# EAGLE design DynamixelController (EAGLE 6.5.0)
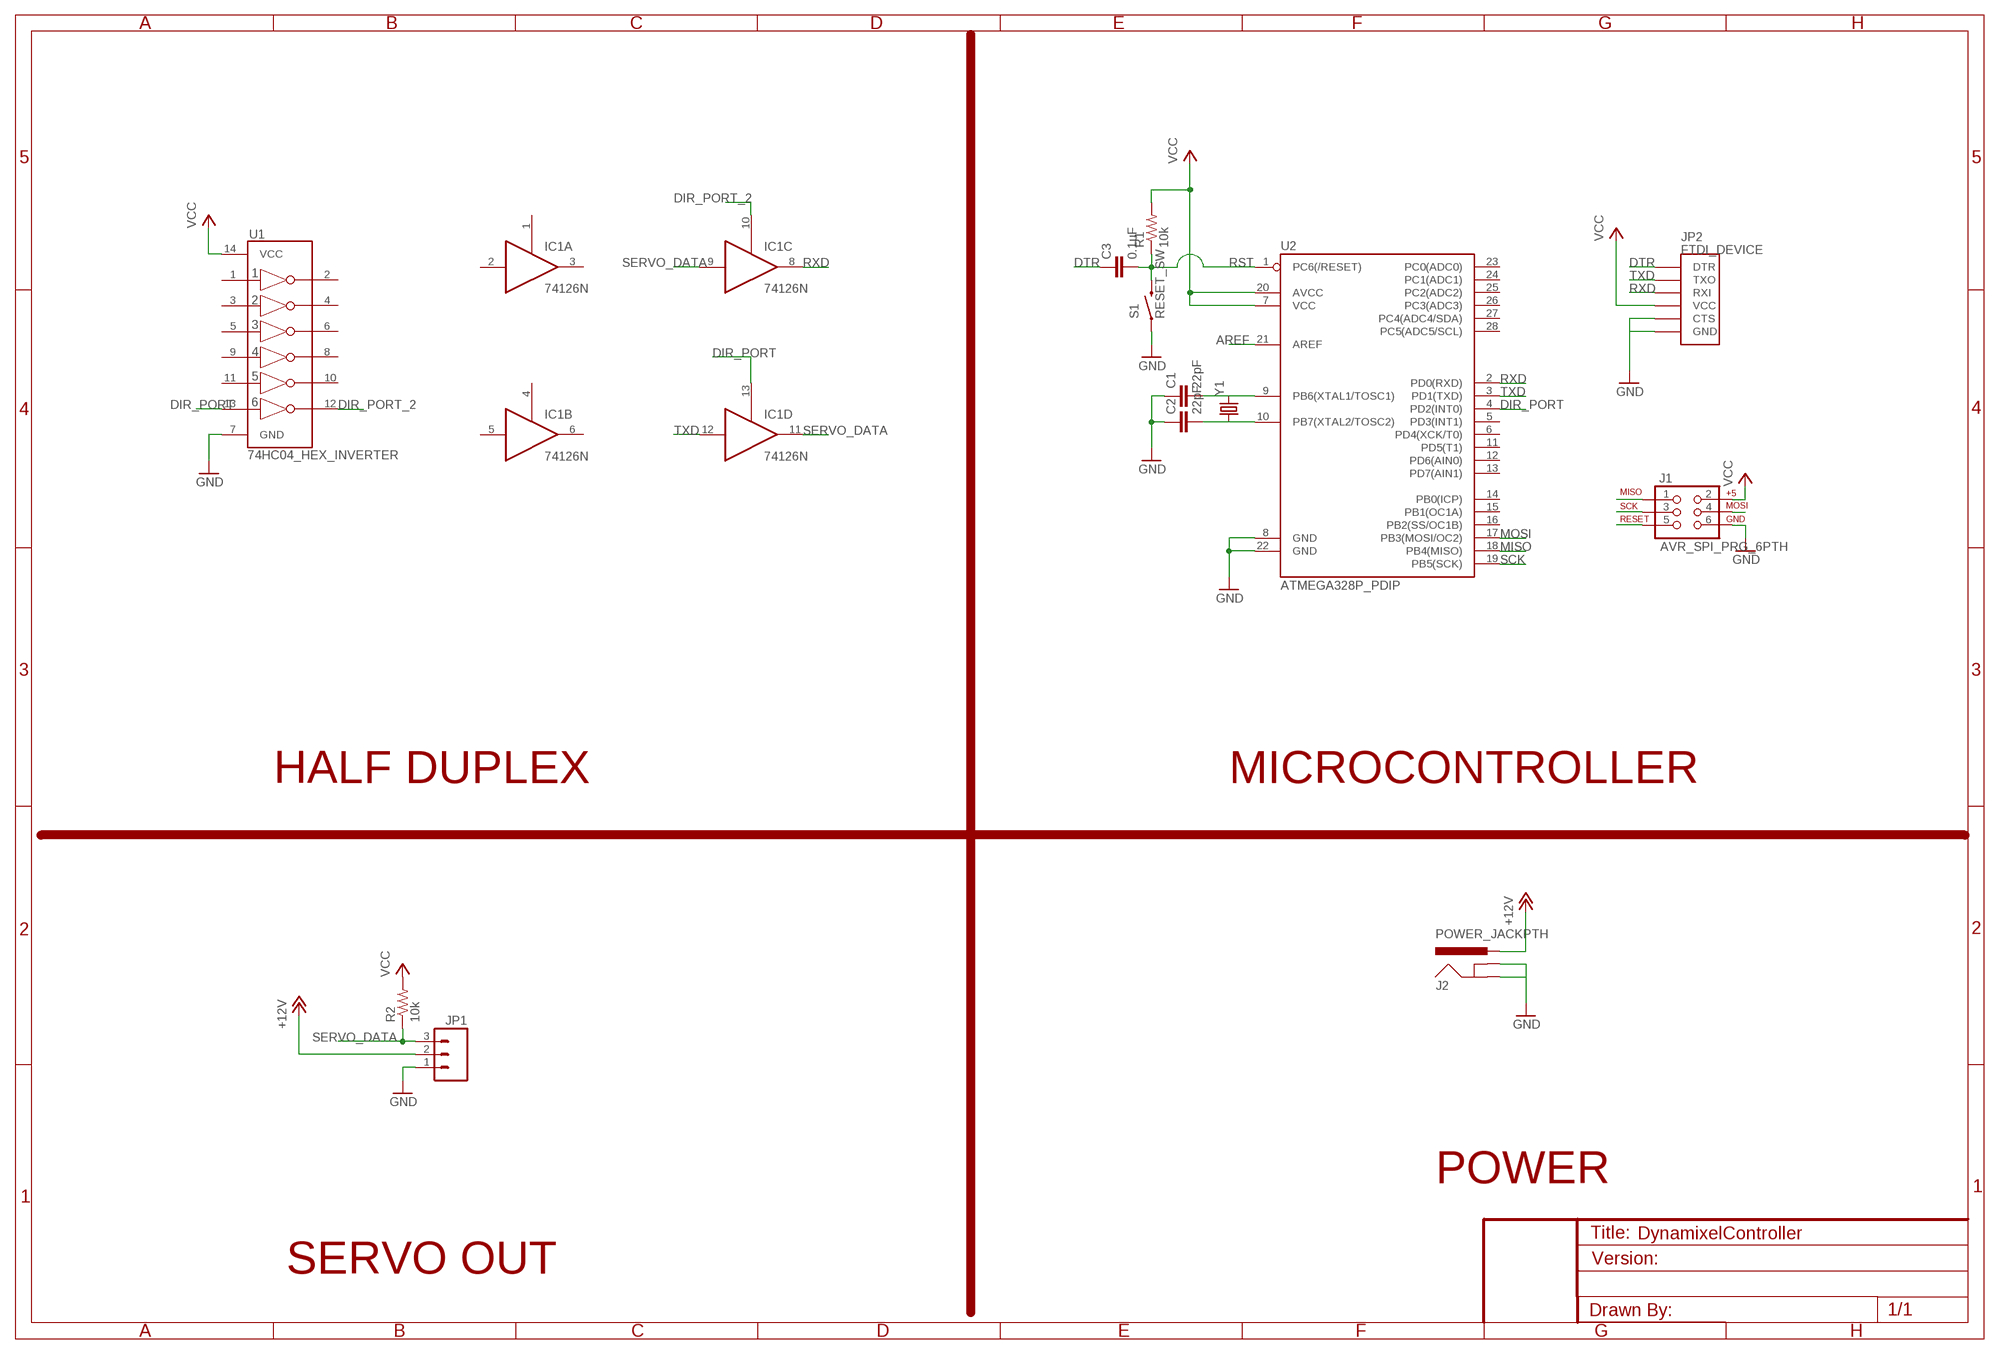
[diagram p0: schematic, sheet 1]

## Parts
C1  22pF  C-EU050-024X044  [C050-024X044]
C2  22pF  C-EU050-024X044  [C050-024X044]
C3  0.1uF  C-EU050-024X044  [C050-024X044]
IC1  74126N  [DIL14]
J1  AVR_SPI_PRG_6PTH  [2X3]
J2  POWER_JACKPTH  [POWER_JACK_PTH]
JP1  M03POLAR  [MOLEX-1X3]
JP2  FTDI_DEVICE  [FTDI_DEVICE_SIDE]
R1  10k  R-US_0207/7  [0207/7]
R2  10k  R-US_0207/7  [0207/7]
S1  RESET_SW  SWITCH-MOMENTARY-2PTH  [TACTILE-PTH]
U1  74HC04_HEX_INVERTER  [DIL14]
U2  ATMEGA328P_PDIP  [DIL28-3]
Y1  CRYSTALHC49US  [HC49US]

## Nets
+12V: J2.PWR JP1.2
AREF: U2.21(AREF)
DIR_PORT: IC1.13(D:OE) U1.13(6A) U2.4(PD2(INT0))
DIR_PORT_2: IC1.10(C:OE) U1.12(6Y)
DTR: C3.1 JP2.P$1(DTR)
GND: C1.1 C2.1 J1.6 J2.GND J2.GNDBREAK JP1.1 JP2.P$5(CTS) JP2.P$6(GND) S1.1 U1.7(GND) U2.8(GND) U2.22(GND)
MISO: J1.1 U2.18(PB4(MISO))
MOSI: J1.4 U2.17(PB3(MOSI/OC2))
N$2: C1.2 U2.9(PB6(XTAL1/TOSC1)) Y1.2
N$3: C2.2 U2.10(PB7(XTAL2/TOSC2)) Y1.1
RST: C3.2 J1.5 R1.1 S1.3 U2.1(PC6(/RESET))
RXD: IC1.8(C:O) JP2.P$3(RXI) U2.2(PD0(RXD))
SCK: J1.3 U2.19(PB5(SCK))
SERVO_DATA: IC1.9(C:I) IC1.11(D:O) JP1.3 R2.1
TXD: IC1.12(D:I) JP2.P$2(TXO) U2.3(PD1(TXD))
VCC: J1.2 JP2.P$4(VCC) R1.2 R2.2 U1.14(VCC) U2.7(VCC) U2.20(AVCC)
Unconnected: IC1.1(A:OE) IC1.2(A:I) IC1.3(A:O) IC1.4(B:OE) IC1.5(B:I) IC1.6(B:O) U1.1(1A) U1.2(1Y) U1.3(2A) U1.4(2Y) U1.5(3A) U1.6(3Y) U1.8(4Y) U1.9(4A) U1.10(5Y) U1.11(5A) U2.5(PD3(INT1)) U2.6(PD4(XCK/T0)) U2.11(PD5(T1)) U2.12(PD6(AIN0)) U2.13(PD7(AIN1)) U2.14(PB0(ICP)) U2.15(PB1(OC1A)) U2.16(PB2(SS/OC1B)) U2.23(PC0(ADC0)) U2.24(PC1(ADC1)) U2.25(PC2(ADC2)) U2.26(PC3(ADC3)) U2.27(PC4(ADC4/SDA)) U2.28(PC5(ADC5/SCL))

## Notes on the sheet
- HALF DUPLEX | MICROCONTROLLER
- POWER
- SERVO OUT

## Power pins joined to a net without a drawn wire
GND: IC1.7(P:GND)
VCC: IC1.14(P:VCC)

## Library data of the parts
C1-C3 = rcl:C-EU: CAPACITOR, European symbol
IC1 = 74xx-us:74*126: Quad bus BUFFER, 3-state
J1 = SparkFun-Connectors:AVR_SPI_PRG_6: AVR ISP 6 Pin This is the reduced ISP connector for AVR programming. Common on Arduino. This footprint will take up less PCB space and can be used with a 10-pin to 6-pin adapter such as SKU: BOB-08508
J2 = SparkFun-Connectors:POWER_JACK: Power Jack This is the standard 5.5mm barrel jack for power. The PTH is the most common, proven, reliable, footprint. The Slot footprint only works if the mill layer is transmitted to the PCB fab house so be warned. Spark Fun Electronics SKU : PRT-00119 SMT: CONN-08106 Mating wall wart : TOL-00298 (and others)
JP1 = SparkFun-Connectors:M03: Header 3 Standard 3-pin 0.1" header. Use with straight break away headers (SKU : PRT-00116), right angle break away headers (PRT-00553), swiss pins (PRT-00743), machine pins (PRT-00117), and female headers (PRT-00115). Molex polarized connector foot print use with SKU : PRT-08232 with associated crimp pins and housings.
JP2 = SparkFun-Connectors:FTDI_DEVICE: Connector which mates to FTDI basic or FTDI cable.
R1 R2 = rcl:R-US_: RESISTOR, American symbol
S1 = SparkFun-Electromechanical:SWITCH-MOMENTARY-2: Various NO switches- pushbuttons, reed, etc
U1 = SparkFun-DigitalIC:74HC04_HEX_INVERTER: 74HC04 Hex Inverter
U2 = SparkFun-DigitalIC:ATMEGA328P_PDIP: uC used in the Arduino 32kb flash, 1k EEPROM, 2k SRAM This is the through-hole version of this chip.
Y1 = SparkFun-FreqCtrl:CRYSTAL: Various standard crystals. Proven footprints. Spark Fun Electronics SKU : COM-00534

## Board
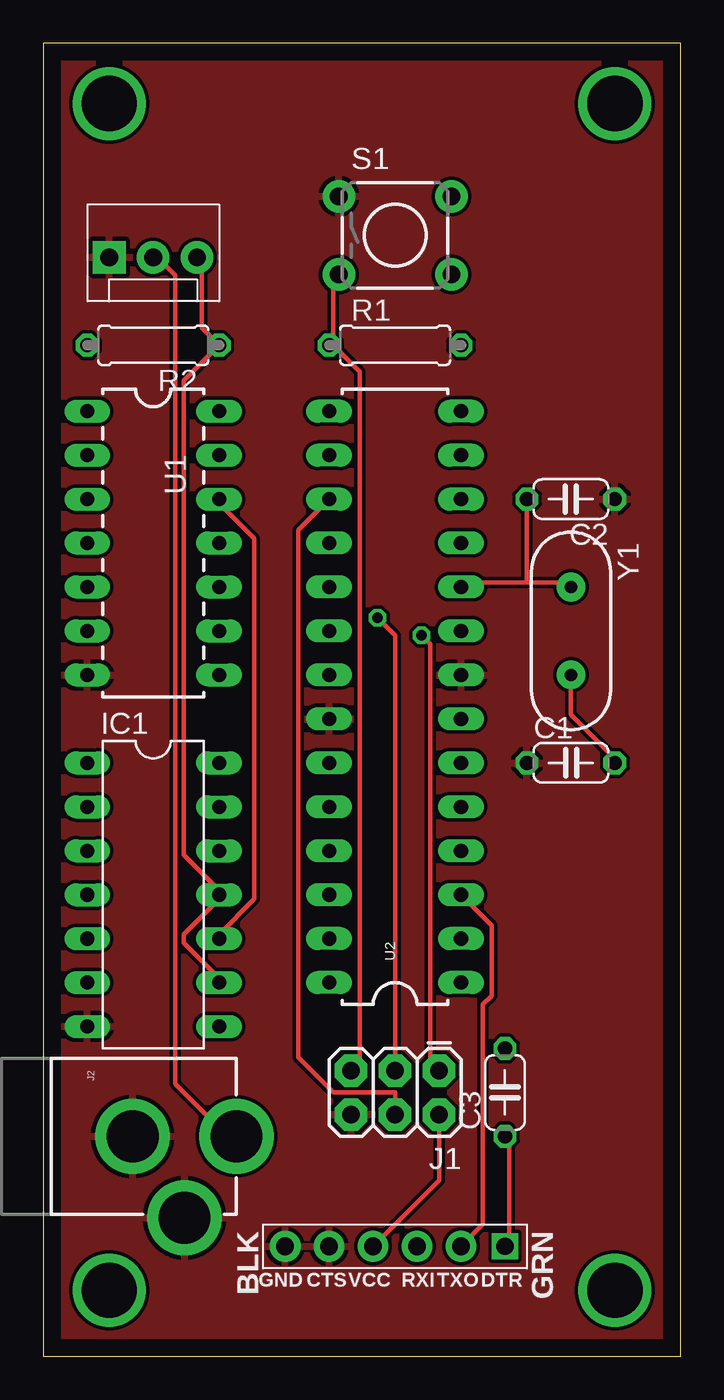
[diagram p1: board, top side]
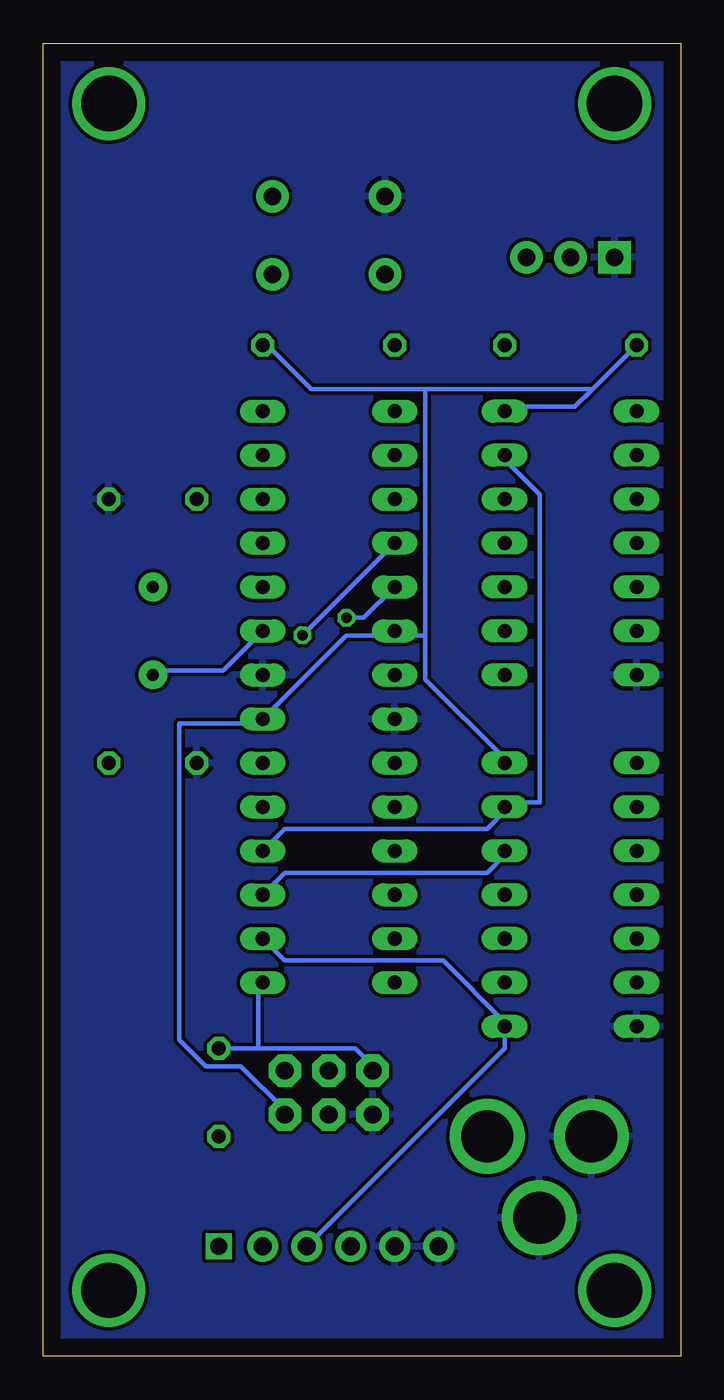
[diagram p2: board, bottom side, seen from below]

Size 36.81 x 75.87 mm. Coordinates in mm from the lower left corner, seen from the top.
Outline: 0,0 36.81,0 36.81,75.87 0,75.87 0,0
Copper layers (1*16): Top 0.035mm / dielectric 1.5mm / Bottom 0.035mm
Design rules "default": minimum track width 10mil, minimum drill 24mil, track to track 8mil, track to pad 8mil, pad to pad 8mil, via to via 8mil, smd to smd 8mil, copper to edge 40mil, drill to drill 8mil, minimum pad ring 10mil, minimum via ring 8mil, stop-mask expansion 4mil, vias tented up to drill 0mil, thermal gap 10mil

### Footprints (pad centres in the part's own frame; a part is rotated, then mirrored left to right if it is on the bottom)
C050-024X044 = drill 0.813 octagon: 1 -2.54,0; 2 2.54,0
DIL14 = drill 0.813 long: 1 -7.62,-3.81; 2 -5.08,-3.81; 3 -2.54,-3.81; 4 0,-3.81; 5 2.54,-3.81; 6 5.08,-3.81; 7 7.62,-3.81; 8 7.62,3.81; 9 5.08,3.81; 10 2.54,3.81; 11 0,3.81; 12 -2.54,3.81; 13 -5.08,3.81; 14 -7.62,3.81
2X3 = drill 1.016 pad 1.88 octagon: 1 0,0; 2 0,2.54; 3 2.54,0; 4 2.54,2.54; 5 5.08,0; 6 5.08,2.54
POWER_JACK_PTH = drill 2.997 pad 4.318: GND 0,7.7; GNDBREAK 4.7,10.7; PWR 0,13.7
MOLEX-1X3 = drill 1.016 pad 1.88 square: 1 0,0 | drill 1.016 pad 1.88: 2 2.54,0; 3 5.08,0
FTDI_DEVICE_SIDE = drill 1 square: P$1 -6.35,0 | drill 1.016 pad 1.778: P$2 -3.81,0; P$3 -1.27,0; P$4 1.27,0; P$5 3.81,0; P$6 6.35,0
0207/7 = drill 0.813 octagon: 1 -3.81,0; 2 3.81,0
TACTILE-PTH = drill 1.016 pad 1.88: 1 -3.251,2.261; 2 3.251,2.261; 3 -3.251,-2.261; 4 3.251,-2.261
DIL14' = drill 0.813 long: 1 -8.89,-3.81; 2 -6.35,-3.81; 3 -3.81,-3.81; 4 -1.27,-3.81; 5 1.27,-3.81; 6 3.81,-3.81; 7 6.35,-3.81; 8 6.35,3.81; 9 3.81,3.81; 10 1.27,3.81; 11 -1.27,3.81; 12 -3.81,3.81; 13 -6.35,3.81; 14 -8.89,3.81
DIL28-3 = drill 0.813 long: 1 -16.51,-3.81; 2 -13.97,-3.81; 3 -11.43,-3.81; 4 -8.89,-3.81; 5 -6.35,-3.81; 6 -3.81,-3.81; 7 -1.27,-3.81; 8 1.27,-3.81; 9 3.81,-3.81; 10 6.35,-3.81; 11 8.89,-3.81; 12 11.43,-3.81; 13 13.97,-3.81; 14 16.51,-3.81; 15 16.51,3.81; 16 13.97,3.81; 17 11.43,3.81; 18 8.89,3.81; 19 6.35,3.81; 20 3.81,3.81; 21 1.27,3.81; 22 -1.27,3.81; 23 -3.81,3.81; 24 -6.35,3.81; 25 -8.89,3.81; 26 -11.43,3.81; 27 -13.97,3.81; 28 -16.51,3.81
HC49US = drill 0.7 pad 1.651: 1 -2.54,0; 2 2.54,0

### Placement (x,y rotation side)
C1  30.48,34.29 0 top
C2  30.48,49.53 180 top
C3  26.67,15.24 90 top
IC1  6.35,26.67 270 top
J1  22.86,16.51 180 top
J2  -2.54,12.7 270 top
JP1  3.81,63.5 0 top
JP2  20.32,6.35 180 top
R1  20.32,58.42 0 top
R2  6.35,58.42 180 top
S1  20.32,64.77 0 top
U1  74HC04_HEX_INVERTER  [DIL14']  6.35,45.72 270 top
U2  20.32,38.1 90 top
Y1  30.48,41.91 270 top

### Tracks (layer width: path | path; a pad name or v marks a point on that pad's centre or on a via)
+12V
  Top 0.254: JP1.2 6.6,63.5 7.62,62.48 7.62,15.75 10.67,12.7 J2.PWR
DIR_PORT
  Bottom 0.254: U2.4 22.86,30.48 11.18,30.48 10.16,31.5 IC1.13 10.16,32 8.13,32 8.13,49.78 10.16,51.82 U1.13
DIR_PORT_2
  Top 0.254: IC1.10 10.16,24.38 12.19,26.42 12.19,47.24 10.16,49.28 U1.12
DTR
  Top 0.254: C3.1 26.92,12.7 26.92,6.6 JP2.P$1
GND
  pour Bottom: 0,76.2 36.83,76.2 36.83,0 0,0
  pour Top: 0,76.2 36.83,76.2 36.83,0 0,0
MISO  (via drill 0.61)
  Top 0.254: v21.84,41.66 22.35,41.15 22.35,17.27 22.86,16.76 J1.1
  Bottom 0.254: v21.84,41.66 U2.18
MOSI
  Top 0.254: U2.17 14.73,47.75 14.73,17.27 16.76,15.24 20.32,15.24 J1.4
N$1  (via drill 3.2)
  other vias: 3.81,72.39
N$2
  Top 0.254: Y1.2 30.48,37.08 33.02,34.54 C1.2
  Bottom 0.254: U2.9 26.42,39.62 30.48,39.62 Y1.2
N$3
  Top 0.254: 27.94,44.7 30.48,44.7 Y1.1 | 27.94,44.7 24.38,44.7 U2.10 | 27.94,44.7 C2.2
N$4  (via drill 3.2)
  other vias: 33.02,72.39
N$5  (via drill 3.2)
  other vias: 3.81,3.81
N$6  (via drill 3.2)
  other vias: 33.02,3.81
RST
  Top 0.254: 16.76,58.42 16.76,62.48 S1.3 | 16.76,58.42 18.29,56.9 18.29,17.27 17.78,16.76 J1.5 | 16.76,58.42 R1.1
  Bottom 0.254: 24.38,17.78 24.38,21.34 U2.1 | C3.2 24.38,17.78 | 24.38,17.78 18.8,17.78 17.78,16.76 J1.5
RXD
  Bottom 0.254: U2.2 22.86,22.86 13.72,22.86 10.16,19.3 IC1.8 10.16,17.78 JP2.P$3
SCK  (via drill 0.61)
  Top 0.254: v19.3,42.67 20.32,41.66 J1.3
  Bottom 0.254: U2.19 18.29,42.67 v19.3,42.67
SERVO_DATA
  Top 0.254: IC1.9 10.16,21.84 8.13,23.88 8.13,24.38 10.16,26.42 IC1.11 10.16,26.92 8.13,28.96 8.13,56.39 R2.1 9.14,59.44 9.14,63.5 JP1.3
TXD
  Top 0.254: JP2.P$2 25.4,7.62 25.4,20.32 25.91,20.83 25.91,24.89 U2.3
  Bottom 0.254: U2.3 22.86,27.94 11.18,27.94 10.16,28.96 IC1.12
VCC
  Top 0.254: JP2.P$4 22.86,10.16 J1.2
  Bottom 0.254: 5.08,55.88 6.1,54.86 10.16,54.86 U1.14 | 5.08,55.88 R2.2 | 5.08,55.88 14.73,55.88 | 14.73,55.88 21.34,55.88 23.88,58.42 R1.2 | 14.73,41.66 14.73,39.12 10.16,34.54 IC1.14 | 14.73,41.66 16.26,41.66 U2.20 16.76,41.66 19.3,41.66 U2.7 24.38,36.58 28.96,36.58 28.96,18.29 27.43,16.76 25.4,16.76 22.86,14.22 J1.2 | 14.73,41.66 14.73,55.88